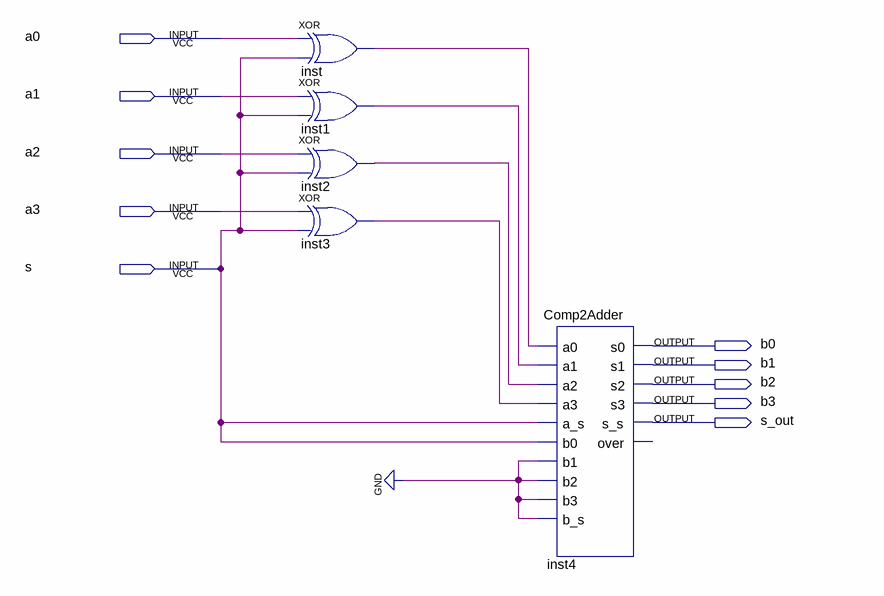
[diagram p0: schematic sheet]
// Quartus schematic Comp12.bdf as structural Verilog: 5 symbols, 10 pins
module Comp12 (
  input  a0,
  input  a1,
  input  a2,
  input  a3,
  input  s,
  output b0,
  output b1,
  output b2,
  output b3,
  output s_out
);

  wire inst1_out, inst2_out, inst3_out, inst_out;

  xor inst (inst_out, a0, s);
  xor inst1 (inst1_out, a1, s);
  xor inst2 (inst2_out, a2, s);
  xor inst3 (inst3_out, a3, s);
  Comp2Adder inst4 (
    .a0(inst_out), .a1(inst1_out), .a2(inst2_out), .a3(inst3_out), .a_s(s), .b0(s), .b1(1'b0), .b2(1'b0),
    .b3(1'b0), .b_s(1'b0), .s0(b0), .s1(b1), .s2(b2), .s3(b3), .s_s(s_out));  // open: over
endmodule
